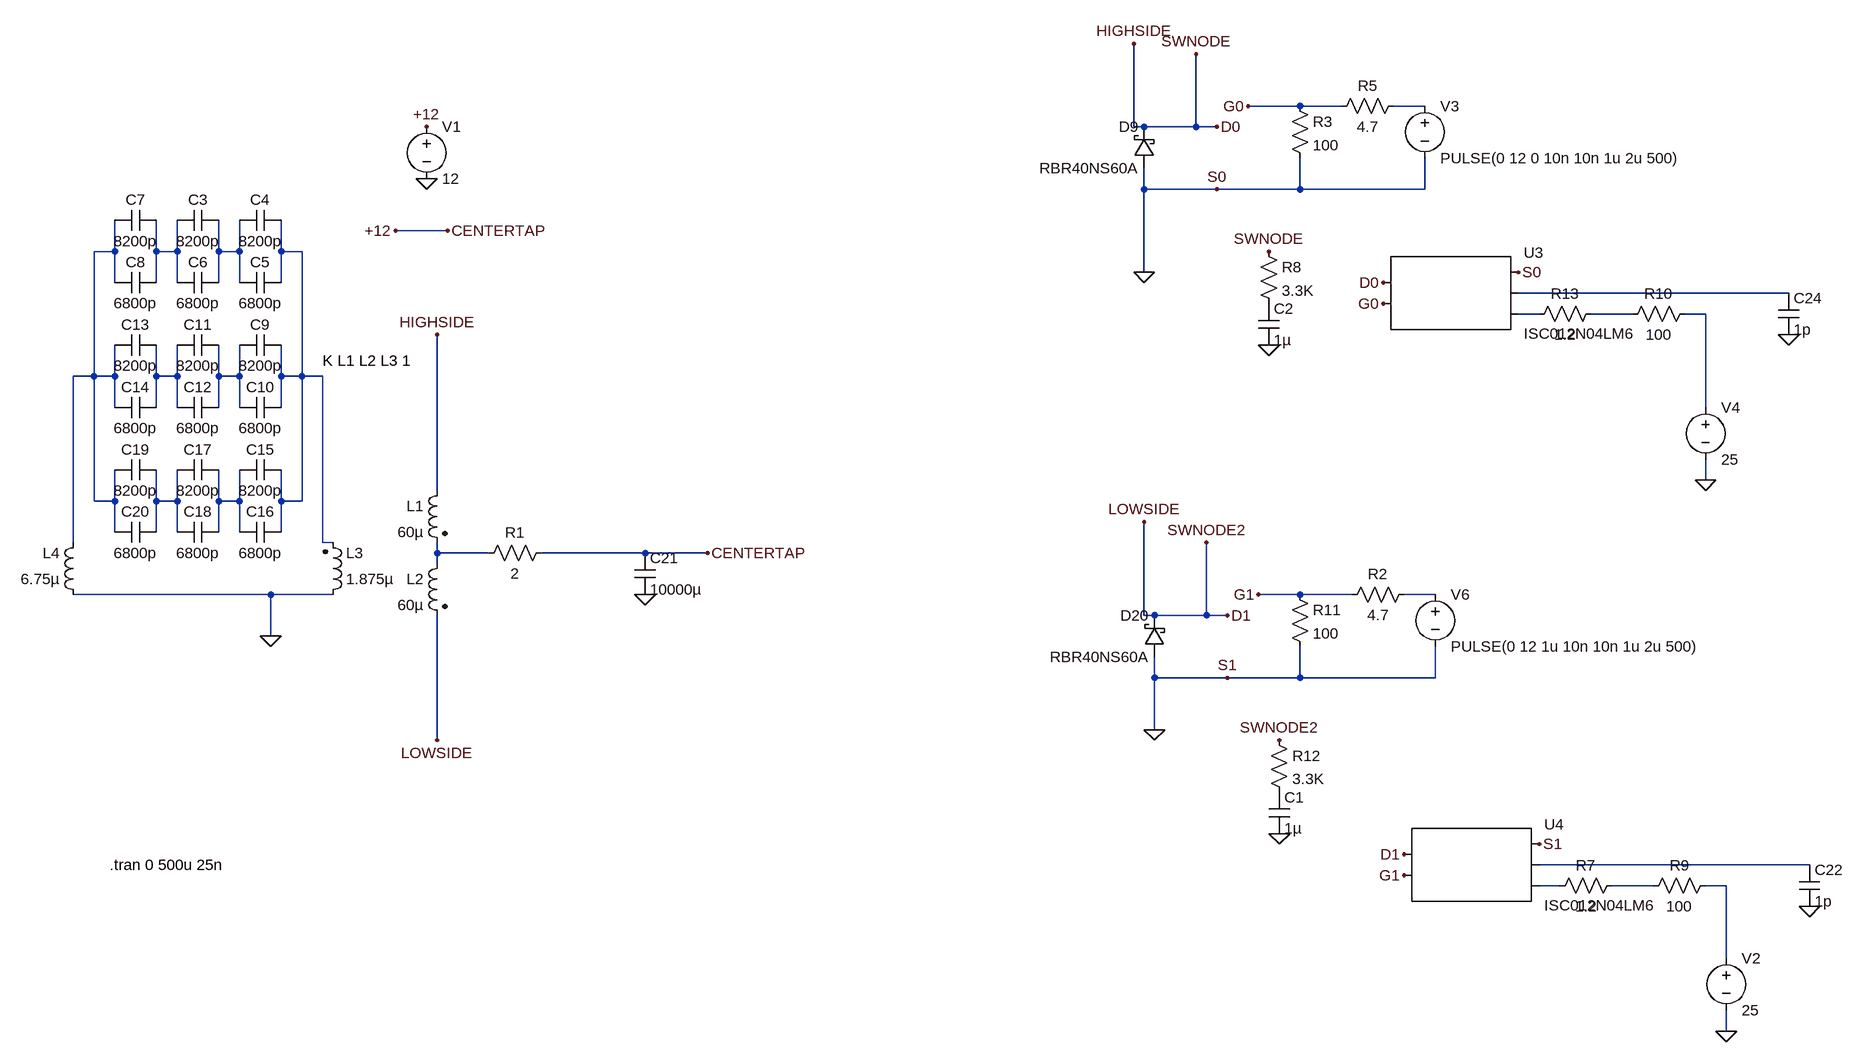
[diagram p0: schematic amf-generator-pushpull.asc]
amf-generator-pushpull.asc, the LTspice schematic file:
Version 4
SHEET 1 7012 1904
WIRE 4752 -432 4672 -432
WIRE 4816 -432 4752 -432
WIRE 4944 -432 4896 -432
WIRE 4496 -400 4496 -528
WIRE 4512 -400 4496 -400
WIRE 4592 -400 4592 -512
WIRE 4592 -400 4512 -400
WIRE 4624 -400 4592 -400
WIRE 4512 -304 4512 -336
WIRE 4624 -304 4512 -304
WIRE 4752 -304 4752 -352
WIRE 4752 -304 4624 -304
WIRE 4944 -304 4944 -352
WIRE 4944 -304 4752 -304
WIRE 3440 -240 3360 -240
WIRE 2928 -208 2928 -256
WIRE 2928 -208 2896 -208
WIRE 2992 -208 2992 -256
WIRE 3024 -208 3024 -256
WIRE 3024 -208 2992 -208
WIRE 3088 -208 3088 -256
WIRE 3120 -208 3120 -256
WIRE 3120 -208 3088 -208
WIRE 3184 -208 3184 -256
WIRE 3216 -208 3184 -208
WIRE 4512 -176 4512 -304
WIRE 2928 -160 2928 -208
WIRE 2992 -160 2992 -208
WIRE 3024 -160 3024 -208
WIRE 3088 -160 3088 -208
WIRE 3120 -160 3120 -208
WIRE 3184 -160 3184 -208
WIRE 5504 -144 5088 -144
WIRE 5120 -112 5088 -112
WIRE 5264 -112 5200 -112
WIRE 5376 -112 5344 -112
WIRE 2896 -16 2896 -208
WIRE 2896 -16 2864 -16
WIRE 2928 -16 2928 -64
WIRE 2928 -16 2896 -16
WIRE 2992 -16 2992 -64
WIRE 3024 -16 3024 -64
WIRE 3024 -16 2992 -16
WIRE 3088 -16 3088 -64
WIRE 3120 -16 3120 -64
WIRE 3120 -16 3088 -16
WIRE 3184 -16 3184 -64
WIRE 3216 -16 3216 -208
WIRE 3216 -16 3184 -16
WIRE 3248 -16 3216 -16
WIRE 2928 32 2928 -16
WIRE 2992 32 2992 -16
WIRE 3024 32 3024 -16
WIRE 3088 32 3088 -16
WIRE 3120 32 3120 -16
WIRE 3184 32 3184 -16
WIRE 5376 32 5376 -112
WIRE 5376 144 5376 112
WIRE 3424 160 3424 -80
WIRE 2896 176 2896 -16
WIRE 2928 176 2928 128
WIRE 2928 176 2896 176
WIRE 2992 176 2992 128
WIRE 3024 176 3024 128
WIRE 3024 176 2992 176
WIRE 3088 176 3088 128
WIRE 3120 176 3120 128
WIRE 3120 176 3088 176
WIRE 3184 176 3184 128
WIRE 3216 176 3216 -16
WIRE 3216 176 3184 176
WIRE 2928 224 2928 176
WIRE 2992 224 2992 176
WIRE 3024 224 3024 176
WIRE 3088 224 3088 176
WIRE 3120 224 3120 176
WIRE 3184 224 3184 176
WIRE 2864 240 2864 -16
WIRE 3248 240 3248 -16
WIRE 3264 240 3248 240
WIRE 3424 256 3424 240
WIRE 3504 256 3424 256
WIRE 3744 256 3584 256
WIRE 3840 256 3744 256
WIRE 3424 272 3424 256
WIRE 3168 320 2864 320
WIRE 3264 320 3168 320
WIRE 4752 320 4688 320
WIRE 4832 320 4752 320
WIRE 4960 320 4912 320
WIRE 4512 352 4512 208
WIRE 4528 352 4512 352
WIRE 4608 352 4608 240
WIRE 4608 352 4528 352
WIRE 4640 352 4608 352
WIRE 3168 384 3168 320
WIRE 4528 448 4528 416
WIRE 4640 448 4528 448
WIRE 4752 448 4752 400
WIRE 4752 448 4640 448
WIRE 4960 448 4960 400
WIRE 4960 448 4752 448
WIRE 4528 528 4528 448
WIRE 3424 544 3424 352
WIRE 5536 736 5120 736
WIRE 5152 768 5120 768
WIRE 5296 768 5232 768
WIRE 5408 768 5376 768
WIRE 5408 880 5408 768
WIRE 5408 992 5408 960
FLAG 4512 -176 0
FLAG 4592 -512 SWNODE
FLAG 4704 -208 SWNODE
FLAG 4704 -64 0
FLAG 3440 -240 CENTERTAP
FLAG 4496 -528 HIGHSIDE
FLAG 4528 528 0
FLAG 4608 240 SWNODE2
FLAG 4720 544 SWNODE2
FLAG 4720 688 0
FLAG 4512 208 LOWSIDE
FLAG 3840 256 CENTERTAP
FLAG 3408 -400 +12
FLAG 3408 -320 0
FLAG 3360 -240 +12
FLAG 3424 -80 HIGHSIDE
FLAG 3424 544 LOWSIDE
FLAG 4624 -400 D0
FLAG 4672 -432 G0
FLAG 4624 -304 S0
FLAG 4880 -160 D0
FLAG 4880 -128 G0
FLAG 5088 -176 S0
FLAG 4640 352 D1
FLAG 4688 320 G1
FLAG 4640 448 S1
FLAG 4912 720 D1
FLAG 4912 752 G1
FLAG 5120 704 S1
FLAG 3168 384 0
FLAG 5408 992 0
FLAG 5536 800 0
FLAG 5376 144 0
FLAG 5504 -80 0
FLAG 3744 320 0
SYMBOL voltage 3408 -416 R0
SYMATTR InstName V1
SYMATTR Value 12
SYMATTR SpiceLine Rser=100m
SYMBOL voltage 4944 -448 R0
SYMATTR InstName V3
SYMATTR Value PULSE(0 12 0 10n 10n 1u 2u 500)
SYMATTR SpiceLine Rser=50m
SYMBOL Res 4736 -448 R0
SYMATTR InstName R3
SYMATTR Value 100
SYMBOL Res 4688 -224 R0
SYMATTR InstName R8
SYMATTR Value 3.3K
SYMBOL schottky 4528 -336 R180
WINDOW 0 24 64 Left 2
WINDOW 3 24 0 Left 2
SYMATTR InstName D9
SYMATTR Value RBR40NS60A
SYMBOL voltage 4960 304 R0
SYMATTR InstName V6
SYMATTR Value PULSE(0 12 1u 10n 10n 1u 2u 500)
SYMATTR SpiceLine Rser=50m
SYMBOL Res 4736 304 R0
SYMATTR InstName R11
SYMATTR Value 100
SYMBOL Res 4704 528 R0
SYMATTR InstName R12
SYMATTR Value 3.3K
SYMBOL schottky 4544 416 R180
WINDOW 0 24 64 Left 2
WINDOW 3 24 0 Left 2
SYMATTR InstName D20
SYMATTR Value RBR40NS60A
SYMBOL ind2 3440 144 M0
SYMATTR InstName L1
SYMATTR Value 60µ
SYMATTR Type ind
SYMATTR SpiceLine Rser=12m
SYMBOL ind2 3440 256 M0
SYMATTR InstName L2
SYMATTR Value 60µ
SYMATTR Type ind
SYMATTR SpiceLine Rser=12m
SYMBOL ind2 3248 336 M180
WINDOW 0 36 80 Left 2
WINDOW 3 36 40 Left 2
SYMATTR InstName L3
SYMATTR Value 1.875µ
SYMATTR SpiceLine Rser=0.25m
SYMBOL ind 2880 336 R180
WINDOW 0 36 80 Left 2
WINDOW 3 36 40 Left 2
SYMATTR InstName L4
SYMATTR Value 6.75µ
SYMATTR SpiceLine Rser=5m
SYMBOL Cap 4704 624 R0
SYMATTR InstName C1
SYMATTR Value 1µ
SYMBOL Cap 4688 -128 R0
SYMATTR InstName C2
SYMATTR Value 1µ
SYMBOL AutoGenerated/ISC012N04LM6 4976 -144 R0
SYMATTR InstName U3
SYMBOL AutoGenerated/ISC012N04LM6 5008 736 R0
SYMATTR InstName U4
SYMBOL Res 4928 304 R90
WINDOW 0 0 56 VBottom 2
WINDOW 3 32 56 VTop 2
SYMATTR InstName R2
SYMATTR Value 4.7
SYMBOL Res 4912 -448 R90
WINDOW 0 0 56 VBottom 2
WINDOW 3 32 56 VTop 2
SYMATTR InstName R5
SYMATTR Value 4.7
SYMBOL Cap 3184 -272 R90
WINDOW 0 0 32 VBottom 2
WINDOW 3 32 32 VTop 2
SYMATTR InstName C4
SYMATTR Value 8200p
SYMBOL Cap 3184 -176 R90
WINDOW 0 0 32 VBottom 2
WINDOW 3 32 32 VTop 2
SYMATTR InstName C5
SYMATTR Value 6800p
SYMATTR SpiceLine Rser=1.2m
SYMBOL Cap 3088 -272 R90
WINDOW 0 0 32 VBottom 2
WINDOW 3 32 32 VTop 2
SYMATTR InstName C3
SYMATTR Value 8200p
SYMBOL Cap 3088 -176 R90
WINDOW 0 0 32 VBottom 2
WINDOW 3 32 32 VTop 2
SYMATTR InstName C6
SYMATTR Value 6800p
SYMATTR SpiceLine Rser=1.2m
SYMBOL Cap 2992 -272 R90
WINDOW 0 0 32 VBottom 2
WINDOW 3 32 32 VTop 2
SYMATTR InstName C7
SYMATTR Value 8200p
SYMBOL Cap 2992 -176 R90
WINDOW 0 0 32 VBottom 2
WINDOW 3 32 32 VTop 2
SYMATTR InstName C8
SYMATTR Value 6800p
SYMATTR SpiceLine Rser=1.2m
SYMBOL Cap 3184 -80 R90
WINDOW 0 0 32 VBottom 2
WINDOW 3 32 32 VTop 2
SYMATTR InstName C9
SYMATTR Value 8200p
SYMBOL Cap 3184 16 R90
WINDOW 0 0 32 VBottom 2
WINDOW 3 32 32 VTop 2
SYMATTR InstName C10
SYMATTR Value 6800p
SYMATTR SpiceLine Rser=1.2m
SYMBOL Cap 3088 -80 R90
WINDOW 0 0 32 VBottom 2
WINDOW 3 32 32 VTop 2
SYMATTR InstName C11
SYMATTR Value 8200p
SYMBOL Cap 3088 16 R90
WINDOW 0 0 32 VBottom 2
WINDOW 3 32 32 VTop 2
SYMATTR InstName C12
SYMATTR Value 6800p
SYMATTR SpiceLine Rser=1.2m
SYMBOL Cap 2992 -80 R90
WINDOW 0 0 32 VBottom 2
WINDOW 3 32 32 VTop 2
SYMATTR InstName C13
SYMATTR Value 8200p
SYMBOL Cap 2992 16 R90
WINDOW 0 0 32 VBottom 2
WINDOW 3 32 32 VTop 2
SYMATTR InstName C14
SYMATTR Value 6800p
SYMATTR SpiceLine Rser=1.2m
SYMBOL Cap 3184 112 R90
WINDOW 0 0 32 VBottom 2
WINDOW 3 32 32 VTop 2
SYMATTR InstName C15
SYMATTR Value 8200p
SYMBOL Cap 3184 208 R90
WINDOW 0 0 32 VBottom 2
WINDOW 3 32 32 VTop 2
SYMATTR InstName C16
SYMATTR Value 6800p
SYMATTR SpiceLine Rser=1.2m
SYMBOL Cap 3088 112 R90
WINDOW 0 0 32 VBottom 2
WINDOW 3 32 32 VTop 2
SYMATTR InstName C17
SYMATTR Value 8200p
SYMBOL Cap 3088 208 R90
WINDOW 0 0 32 VBottom 2
WINDOW 3 32 32 VTop 2
SYMATTR InstName C18
SYMATTR Value 6800p
SYMATTR SpiceLine Rser=1.2m
SYMBOL Cap 2992 112 R90
WINDOW 0 0 32 VBottom 2
WINDOW 3 32 32 VTop 2
SYMATTR InstName C19
SYMATTR Value 8200p
SYMBOL Cap 2992 208 R90
WINDOW 0 0 32 VBottom 2
WINDOW 3 32 32 VTop 2
SYMATTR InstName C20
SYMATTR Value 6800p
SYMATTR SpiceLine Rser=1.2m
SYMBOL Res 5248 752 R90
WINDOW 0 0 56 VBottom 2
WINDOW 3 32 56 VTop 2
SYMATTR InstName R7
SYMATTR Value 1.2
SYMBOL Res 5392 752 R90
WINDOW 0 0 56 VBottom 2
WINDOW 3 32 56 VTop 2
SYMATTR InstName R9
SYMATTR Value 100
SYMBOL Voltage 5408 864 R0
SYMATTR InstName V2
SYMATTR Value 25
SYMBOL Cap 5520 736 R0
SYMATTR InstName C22
SYMATTR Value 1p
SYMBOL Res 5360 -128 R90
WINDOW 0 0 56 VBottom 2
WINDOW 3 32 56 VTop 2
SYMATTR InstName R10
SYMATTR Value 100
SYMBOL Voltage 5376 16 R0
SYMATTR InstName V4
SYMATTR Value 25
SYMBOL Cap 5488 -144 R0
SYMATTR InstName C24
SYMATTR Value 1p
SYMBOL Res 5216 -128 R90
WINDOW 0 0 56 VBottom 2
WINDOW 3 32 56 VTop 2
SYMATTR InstName R13
SYMATTR Value 1.2
SYMBOL Cap 3728 256 R0
SYMATTR InstName C21
SYMATTR Value 10000µ
SYMBOL Res 3600 240 R90
WINDOW 0 0 56 VBottom 2
WINDOW 3 32 56 VTop 2
SYMATTR InstName R1
SYMATTR Value 2
TEXT 2920 736 Left 2 !.tran 0 500u 25n
TEXT 3248 -40 Left 2 !K L1 L2 L3 1

The netlist it stands for:
* amf-generator-pushpull.asc
V1 +12 0 12 Rser=100m
V3 N001 0 PULSE(0 12 0 10n 10n 1u 2u 500) Rser=50m
R3 G0 0 100
R8 D0 P001 3.3K
D9 0 D0 RBR40NS60A
V6 N015 0 PULSE(0 12 1u 10n 10n 1u 2u 500) Rser=50m
R11 G1 0 100
R12 D1 P002 3.3K
D20 0 D1 RBR40NS60A
L1 D0 N014 60µ Rser=12m
L2 N014 D1 60µ Rser=12m
L3 0 N005 1.875µ Rser=0.25m
L4 0 N002 6.75µ Rser=5m
C1 P002 0 1µ
C2 P001 0 1µ
* U3: ISC012N04LM6 (symbol AutoGenerated/ISC012N04LM6 not available, pins judged from their places): pin1=D0 pin2=G0 pin3=0 pin4=N006 pin5=N007
* U4: ISC012N04LM6 (symbol AutoGenerated/ISC012N04LM6 not available, pins judged from their places): pin1=D1 pin2=G1 pin3=0 pin4=N016 pin5=N017
R2 N015 G1 4.7
R5 N001 G0 4.7
C4 N005 N004 8200p
C5 N005 N004 6800p Rser=1.2m
C3 N004 N003 8200p
C6 N004 N003 6800p Rser=1.2m
C7 N003 N002 8200p
C8 N003 N002 6800p Rser=1.2m
C9 N005 N011 8200p
C10 N005 N011 6800p Rser=1.2m
C11 N011 N010 8200p
C12 N011 N010 6800p Rser=1.2m
C13 N010 N002 8200p
C14 N010 N002 6800p Rser=1.2m
C15 N005 N013 8200p
C16 N005 N013 6800p Rser=1.2m
C17 N013 N012 8200p
C18 N013 N012 6800p Rser=1.2m
C19 N012 N002 8200p
C20 N012 N002 6800p Rser=1.2m
R7 N018 N017 1.2
R9 N019 N018 100
V2 N019 0 25
C22 N016 0 1p
R10 N009 N008 100
V4 N009 0 25
C24 N006 0 1p
R13 N008 N007 1.2
C21 +12 0 10000µ
R1 +12 N014 2
.model D D
.lib standard.dio
.tran 0 500u 25n
K L1 L2 L3 1
.backanno
.end